# Altium schematic sheet MCLR.SchDoc
size A4; SheetNumber: 10; SheetTotal: 13
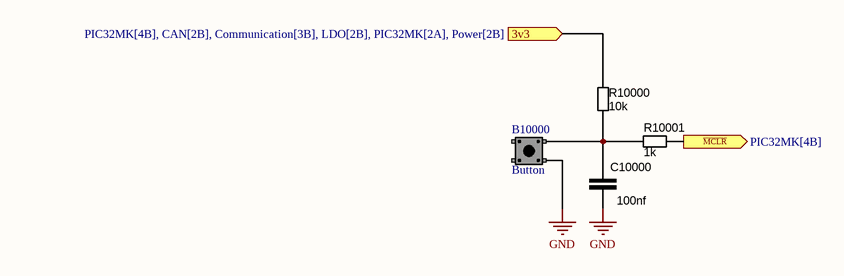
[diagram p0: MCLR.SchDoc]

## Parts
B10000  Button  [ButtonSMD]
C10000  100nf  [CAP_0603]
R10000  10k  [RES_0603]
R10001  1k  [RES_0603]

## Ports
3v3 (in, see PIC32MK[4B], CAN[2B], Communication[3B], LDO[2B], PIC32MK[2A], Power[2B]), ~{MCLR} (out, see PIC32MK[4B])

## Nets
GND: B10000.2 C10000.1
3v3: R10000.2 ; port 3v3
~{MCLR}: R10001.1 ; port ~{MCLR}
NetB10000_1: B10000.1 C10000.2 R10000.1 R10001.2

## Library data of the parts
B10000 = Button: 4 Pin Button
C10000 = C000007: CAP CER 100nF 0603 25V X7R; capaticanse: 100nf; ComponentLink1Description: digikey; ComponentLink1URL: https://www.digikey.com/en/products/detail/kyocera-avx/06033C104K4T2A/8019250
R10000 R10001 = R000006: RES 100K OHM 1% 1/10W 0603; resistance: 100Kohm; ComponentLink1Description: digikey; ComponentLink1URL: https://www.digikey.com/en/products/detail/stackpole-electronics-inc/RMCF0603FG100K/1713543